# EAGLE design project2 (EAGLE 9.6.2)
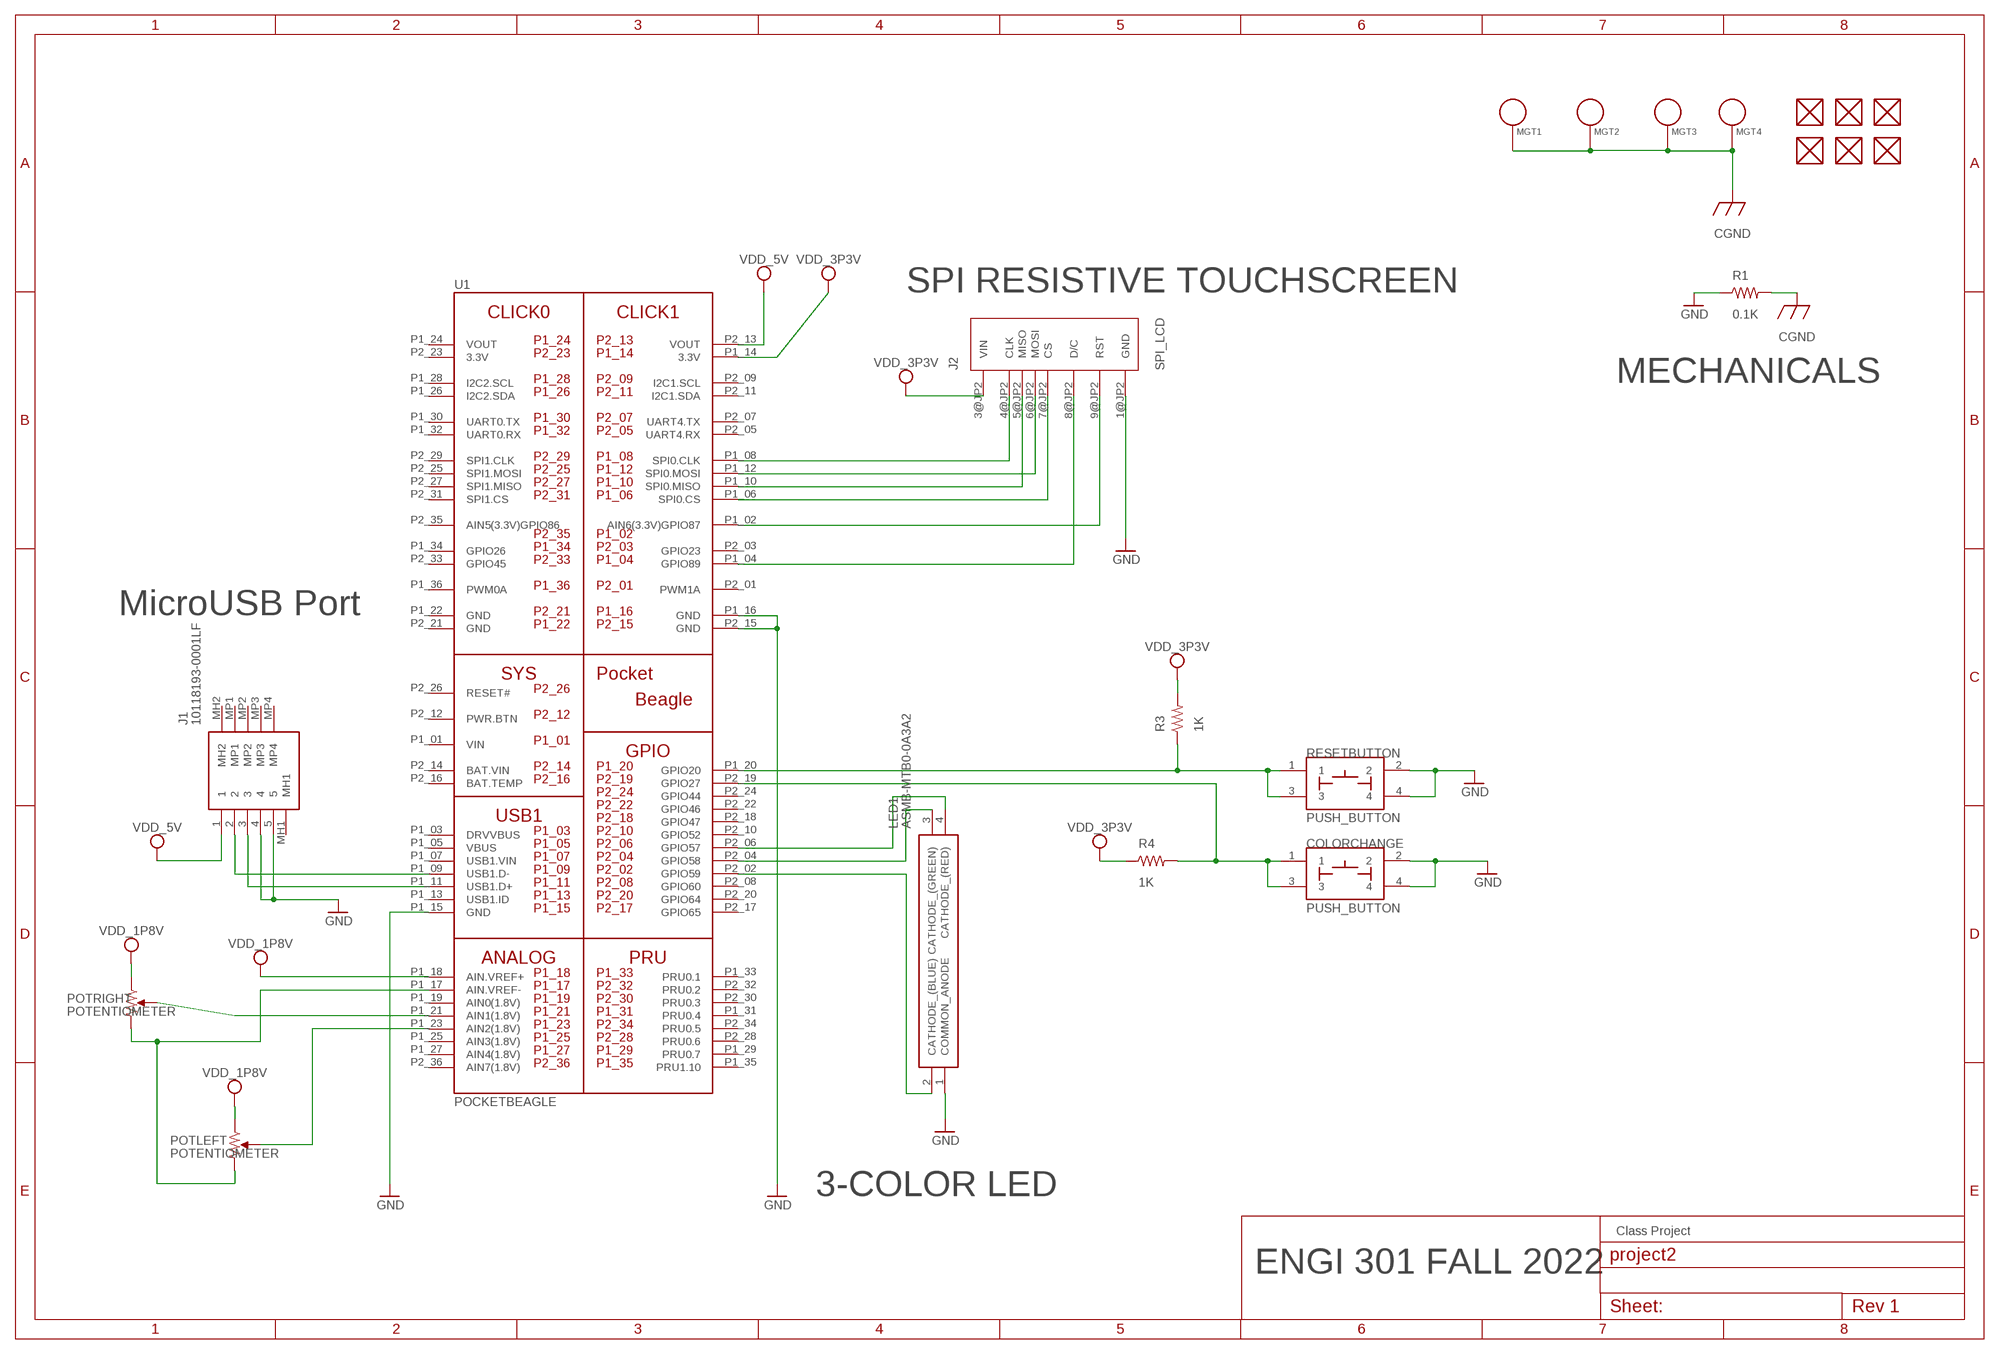
[diagram p0: schematic, sheet 1]

## Parts
COLORCHANGE  PUSH_BUTTON  [BUTTON_12.5MM]
FUD1  FIDUCIAL  [FIDUCIAL_40MIL]
FUD2  FIDUCIAL  [FIDUCIAL_40MIL]
FUD3  FIDUCIAL  [FIDUCIAL_40MIL]
FUD4  FIDUCIAL  [FIDUCIAL_40MIL]
FUD5  FIDUCIAL  [FIDUCIAL_40MIL]
FUD6  FIDUCIAL  [FIDUCIAL_40MIL]
J1  10118193-0001LF  [101181930001LF]
J2  SPI_LCD  [TFT_LCD_PCB]
LED1  ASMB-MTB0-0A3A2  [ASMBMTB00A3A2]
MGT1  MOUNTING_HOLE  [MOUNTING_HOLE]
MGT2  MOUNTING_HOLE  [MOUNTING_HOLE]
MGT3  MOUNTING_HOLE  [MOUNTING_HOLE]
MGT4  MOUNTING_HOLE  [MOUNTING_HOLE]
POTLEFT  POTENTIOMETER  [POT-PO90S]
POTRIGHT  POTENTIOMETER  [POT-PO90S]
R1  0.1K  R_R0603  [R0603]
R3  1K  R_R0603  [R0603]
R4  1K  R_R0603  [R0603]
RESETBUTTON  PUSH_BUTTON  [BUTTON_12.5MM]
U1  POCKETBEAGLE  [POCKETBEAGLE]

## Nets
CGND: MGT1.P$1 MGT2.P$1 MGT3.P$1 MGT4.P$1 R1.2
GND: COLORCHANGE.2 COLORCHANGE.4 J1.4 J1.5 J2.1@JP2(GND) LED1.1(COMMON_ANODE) R1.1 RESETBUTTON.2 RESETBUTTON.4 U1.P1_15(GND) U1.P1_16(GND) U1.P2_15(GND)
N$1: POTRIGHT.S U1.P1_21(AIN1(1.8V))
N$2: POTLEFT.S U1.P1_23(AIN2(1.8V))
N$3: POTLEFT.CW POTRIGHT.CW U1.P1_17(AIN.VREF-)
N$4: R3.1 RESETBUTTON.1 RESETBUTTON.3 U1.P1_20(GPIO20)
N$5: J2.4@JP2(CLK) U1.P1_08(SPI0.CLK)
N$6: J2.5@JP2(MISO) U1.P1_10(SPI0.MISO)
N$7: J2.6@JP2(MOSI) U1.P1_12(SPI0.MOSI)
N$8: J2.7@JP2(CS) U1.P1_06(SPI0.CS)
N$9: J2.8@JP2(D/C) U1.P1_04(GPIO89)
N$10: J2.9@JP2(RST) U1.P1_02(AIN6(3.3V)GPIO87)
N$12: COLORCHANGE.1 COLORCHANGE.3 R4.2 U1.P2_19(GPIO27)
N$13: LED1.2(CATHODE_(BLUE)) U1.P2_02(GPIO59)
N$14: LED1.3(CATHODE_(GREEN)) U1.P2_04(GPIO58)
N$15: LED1.4(CATHODE_(RED)) U1.P2_06(GPIO57)
N$17: J1.2 U1.P1_09(USB1.D-)
N$18: J1.3 U1.P1_11(USB1.D+)
VDD_1P8V: POTLEFT.CCW POTRIGHT.CCW U1.P1_18(AIN.VREF+)
VDD_3P3V: J2.3@JP2(VIN) R3.2 R4.1 U1.P1_14(3.3V)
VDD_5V: J1.1 U1.P2_13(VOUT)
Unconnected: FUD1.P$1 FUD2.P$1 FUD3.P$1 FUD4.P$1 FUD5.P$1 FUD6.P$1 J1.MH1 J1.MH2 J1.MP1 J1.MP2 J1.MP3 J1.MP4 U1.P1_03(DRVVBUS) U1.P1_05(VBUS) U1.P1_07(USB1.VIN) U1.P1_13(USB1.ID) U1.P1_19(AIN0(1.8V)) U1.P1_25(AIN3(1.8V)) U1.P1_26(I2C2.SDA) U1.P1_27(AIN4(1.8V)) U1.P1_28(I2C2.SCL) U1.P1_29(PRU0.7) U1.P1_30(UART0.TX) U1.P1_31(PRU0.4) U1.P1_32(UART0.RX) U1.P1_33(PRU0.1) U1.P1_34(GPIO26) U1.P1_35(PRU1.10) U1.P1_36(PWM0A) U1.P2_01(PWM1A) U1.P2_03(GPIO23) U1.P2_05(UART4.RX) U1.P2_07(UART4.TX) U1.P2_08(GPIO60) U1.P2_09(I2C1.SCL) U1.P2_10(GPIO52) U1.P2_11(I2C1.SDA) U1.P2_12(PWR.BTN) U1.P2_16(BAT.TEMP) U1.P2_17(GPIO65) U1.P2_18(GPIO47) U1.P2_20(GPIO64) U1.P2_22(GPIO46) U1.P2_24(GPIO44) U1.P2_25(SPI1.MOSI) U1.P2_26(RESET#) U1.P2_27(SPI1.MISO) U1.P2_28(PRU0.6) U1.P2_29(SPI1.CLK) U1.P2_30(PRU0.3) U1.P2_31(SPI1.CS) U1.P2_32(PRU0.2) U1.P2_33(GPIO45) U1.P2_34(PRU0.5) U1.P2_35(AIN5(3.3V)GPIO86) U1.P2_36(AIN7(1.8V))

## Notes on the sheet
- SPI RESISTIVE TOUCHSCREEN
- MECHANICALS
- MicroUSB Port
- 3-COLOR LED
- Class Project
- ENGI 301 FALL 2022

## Power pins joined to a net without a drawn wire
3.3V: U1.P2_23(3.3V)
BAT.VIN: U1.P2_14(BAT.VIN)
GND: U1.P1_22(GND) U1.P2_21(GND)
VIN: U1.P1_01(VIN)
VOUT: U1.P1_24(VOUT)

## Library data of the parts
COLORCHANGE RESETBUTTON = project2lib:PUSH_BUTTON
FUD1-FUD6 = project2:FIDUCIAL
J1 = 10118193-0001LF:10118193-0001LF: USB Connectors 5P MICRO USB TYPE B RECEPTACLE W/ PEGS Source: Datasheet <https://cdn.amphenol-icc.com/media/wysiwyg/files/drawing/10118193.pdf>; DESCRIPTION: USB Connectors 5P MICRO USB TYPE B RECEPTACLE W/ PEGS; HEIGHT: 3.3mm; MANUFACTURER_NAME: Amphenol Communication Solutions; MANUFACTURER_PART_NUMBER: 10118193-0001LF; MOUSER_PART_NUMBER: 649-10118193-0001LF; MOUSER_PRICE-STOCK: https://www.mouser.co.uk/ProductDetail/Amphenol-FCI/10118193-0001LF?qs=Ywefl8B65e63Nsqd%252B8HZaQ%3D%3D
J2 = project2:SPI_LCD
LED1 = project2lib:ASMB-MTB0-0A3A2: LED Tri-Color Blue/Green/Red 465nm/522nm/634nm Chip LED 4-Pin PLCC - Tape and Reel Source: Datasheet <https://componentsearchengine.com/Datasheets/2/ASMB-MTB0-0A3A2.pdf>; DESCRIPTION: LED Tri-Color Blue/Green/Red 465nm/522nm/634nm Chip LED 4-Pin PLCC - Tape and Reel; HEIGHT: 1.9mm; MANUFACTURER_NAME: Avago Technologies; MANUFACTURER_PART_NUMBER: ASMB-MTB0-0A3A2; MOUSER_PART_NUMBER: 630-ASMB-MTB0-0A3A2; MOUSER_PRICE-STOCK: https://www.mouser.co.uk/ProductDetail/Broadcom-Avago/ASMB-MTB0-0A3A2?qs=ToP8pWlZ0bPcx4XpibrdbA%3D%3D
MGT1-MGT4 = project2:MOUNTING_HOLE: Chassis Mounting Hole w/GND connection ability
POTLEFT POTRIGHT = project2lib:POTENTIOMETER: Potentiometer - Examples: P090S-14T20BR10K (987-1277-ND)
R1 = project2:R_: RESISTOR, American symbol
R3 R4 = project2lib:R_: RESISTOR, American symbol
U1 = project2lib:POCKETBEAGLE

## Board
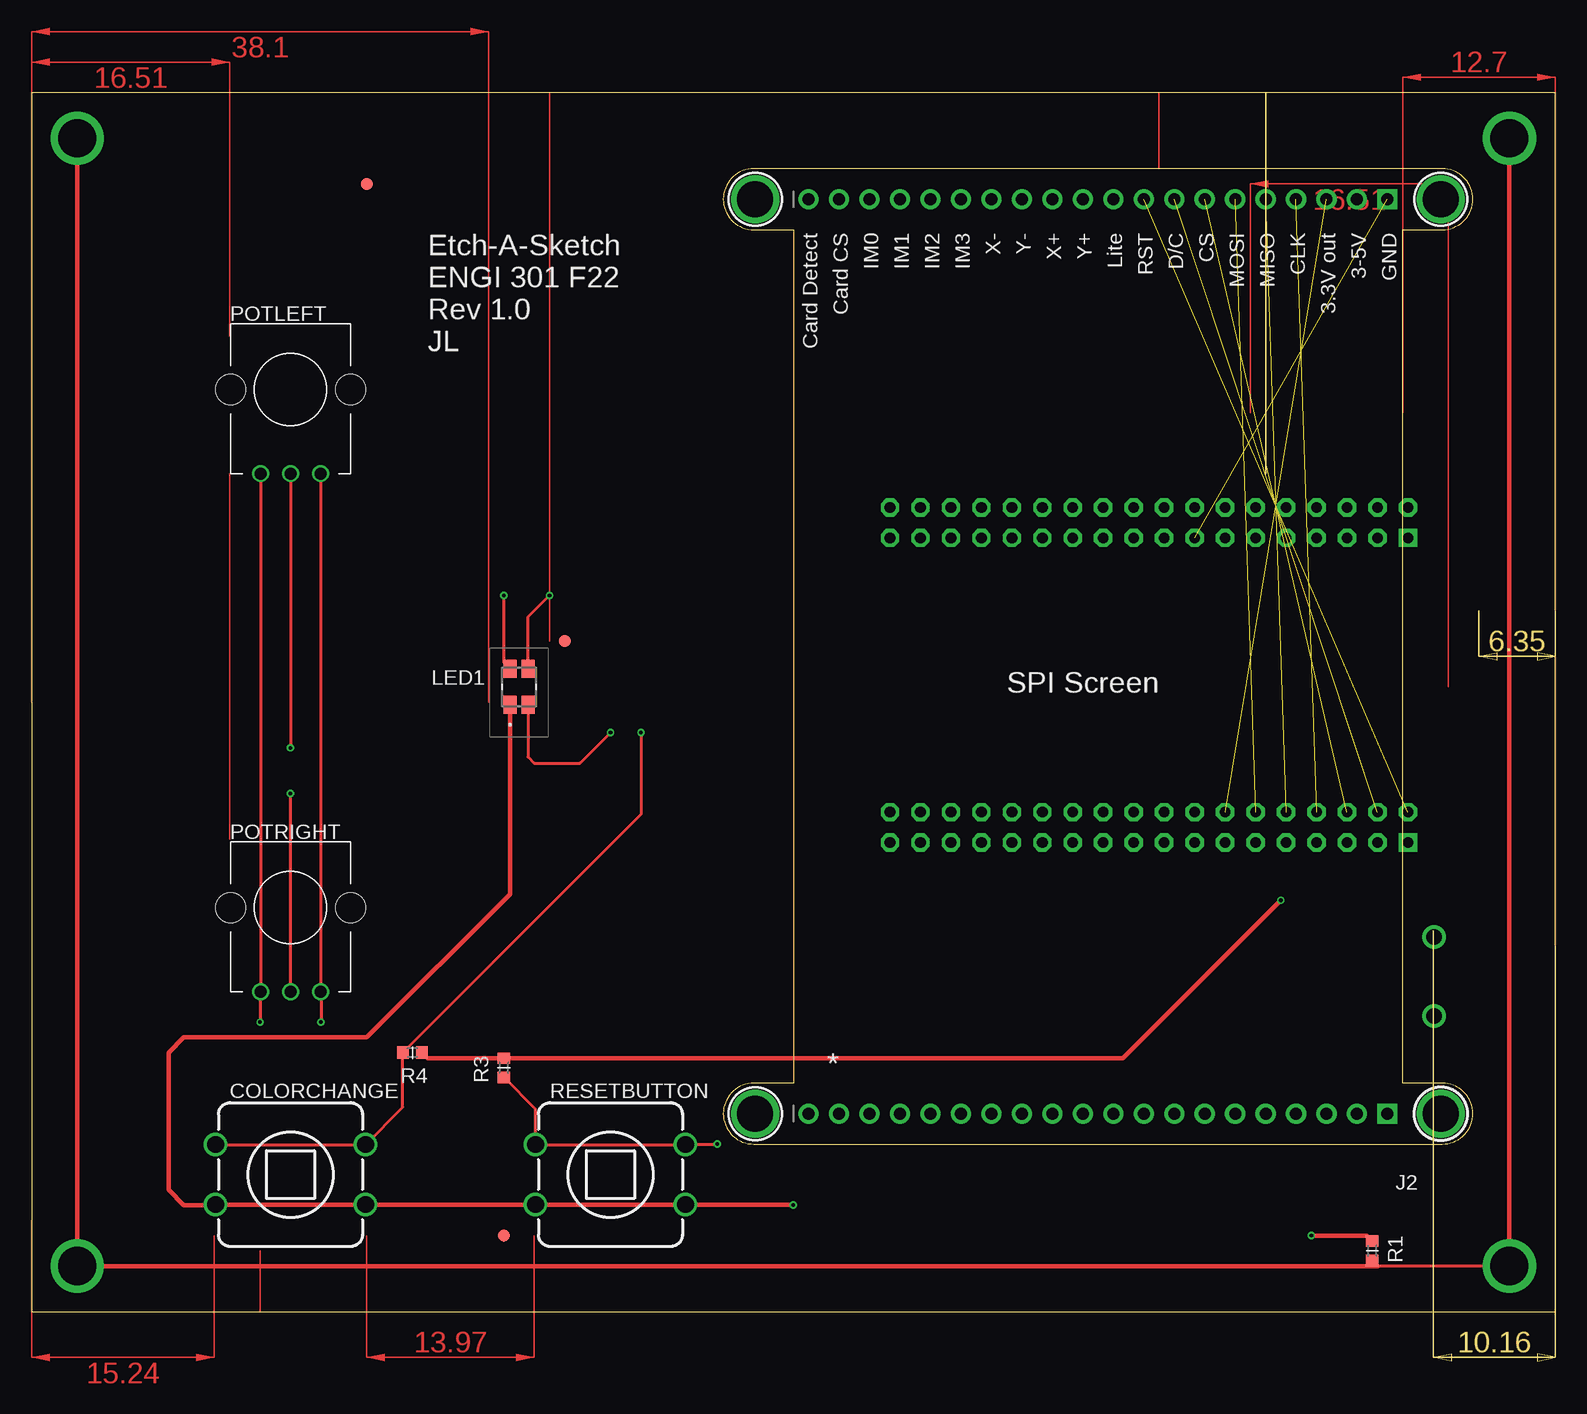
[diagram p1: board, top side]
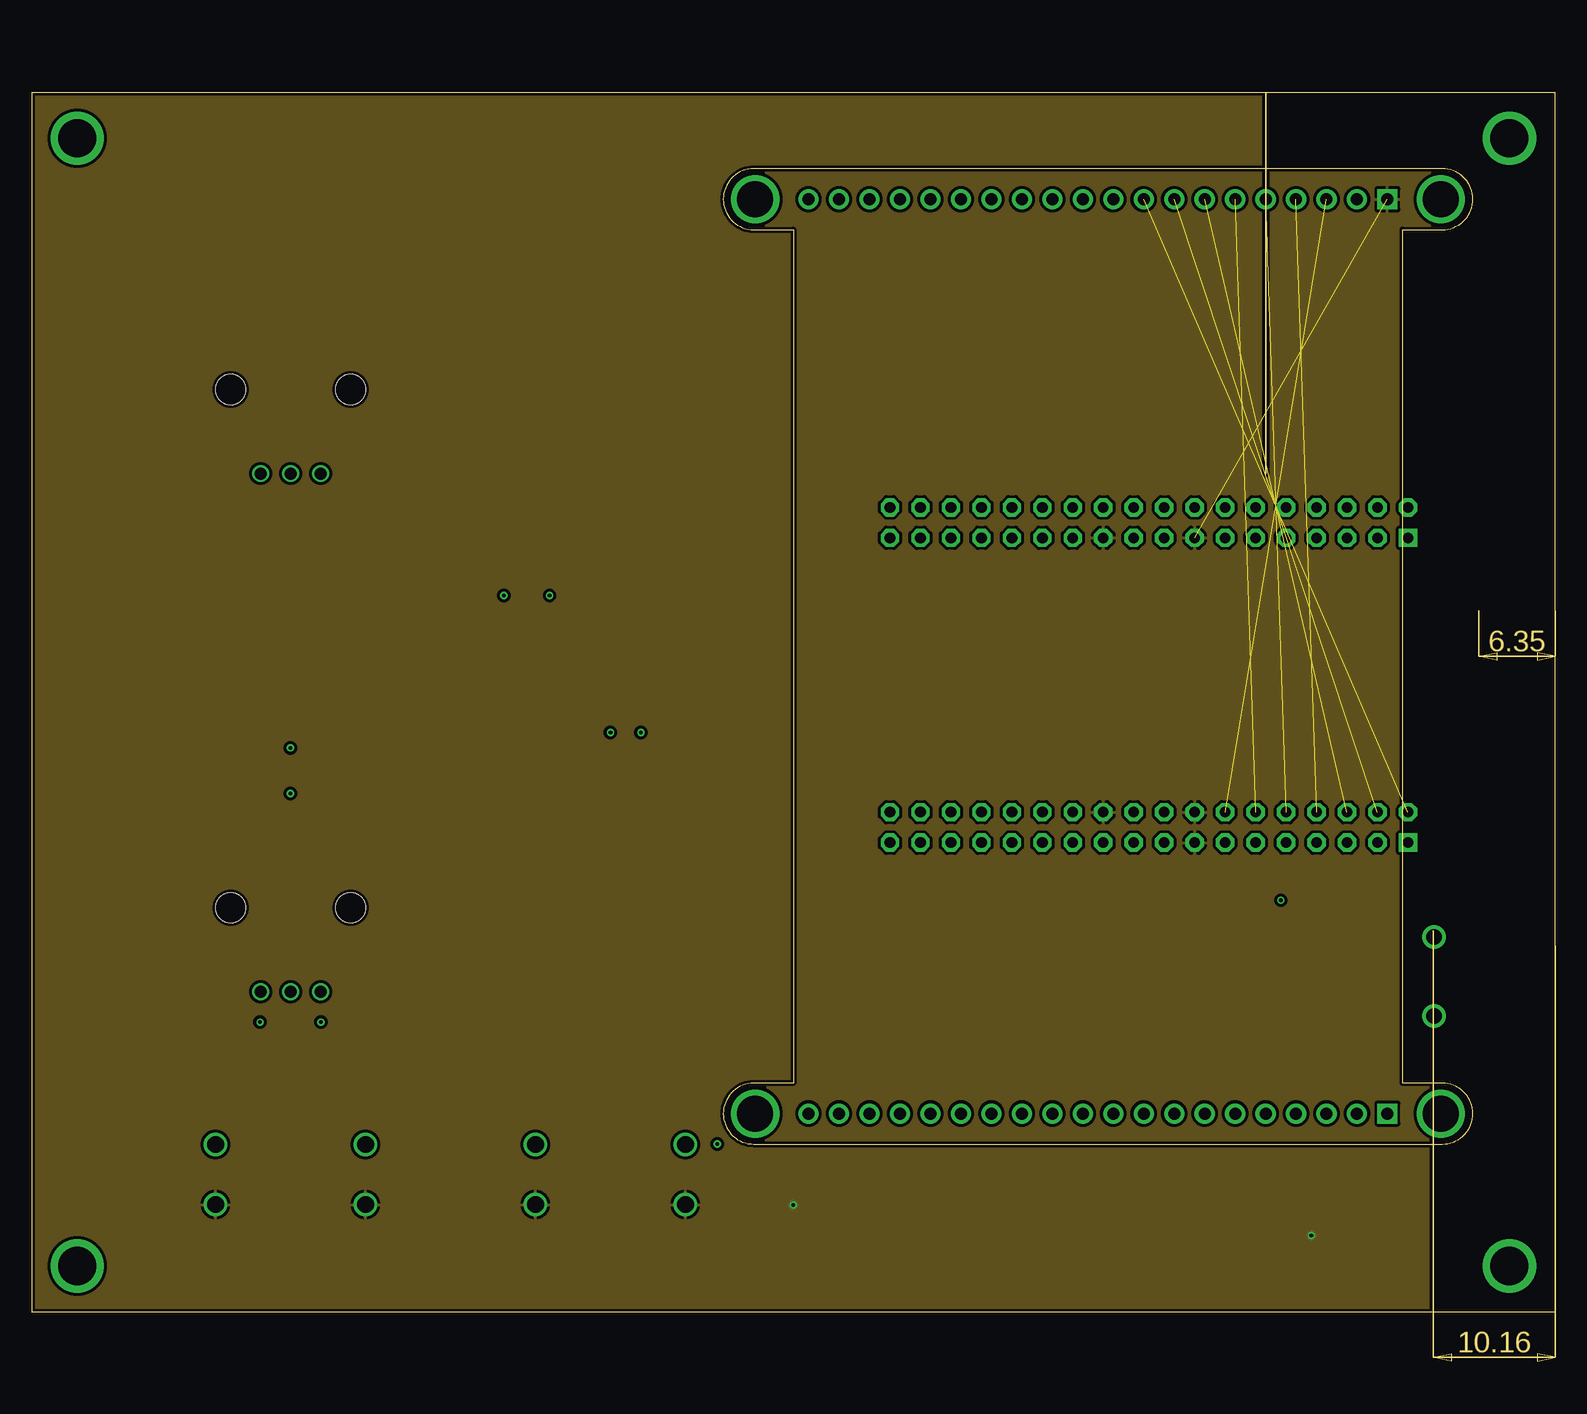
[diagram p2: board, inner layer Route2]
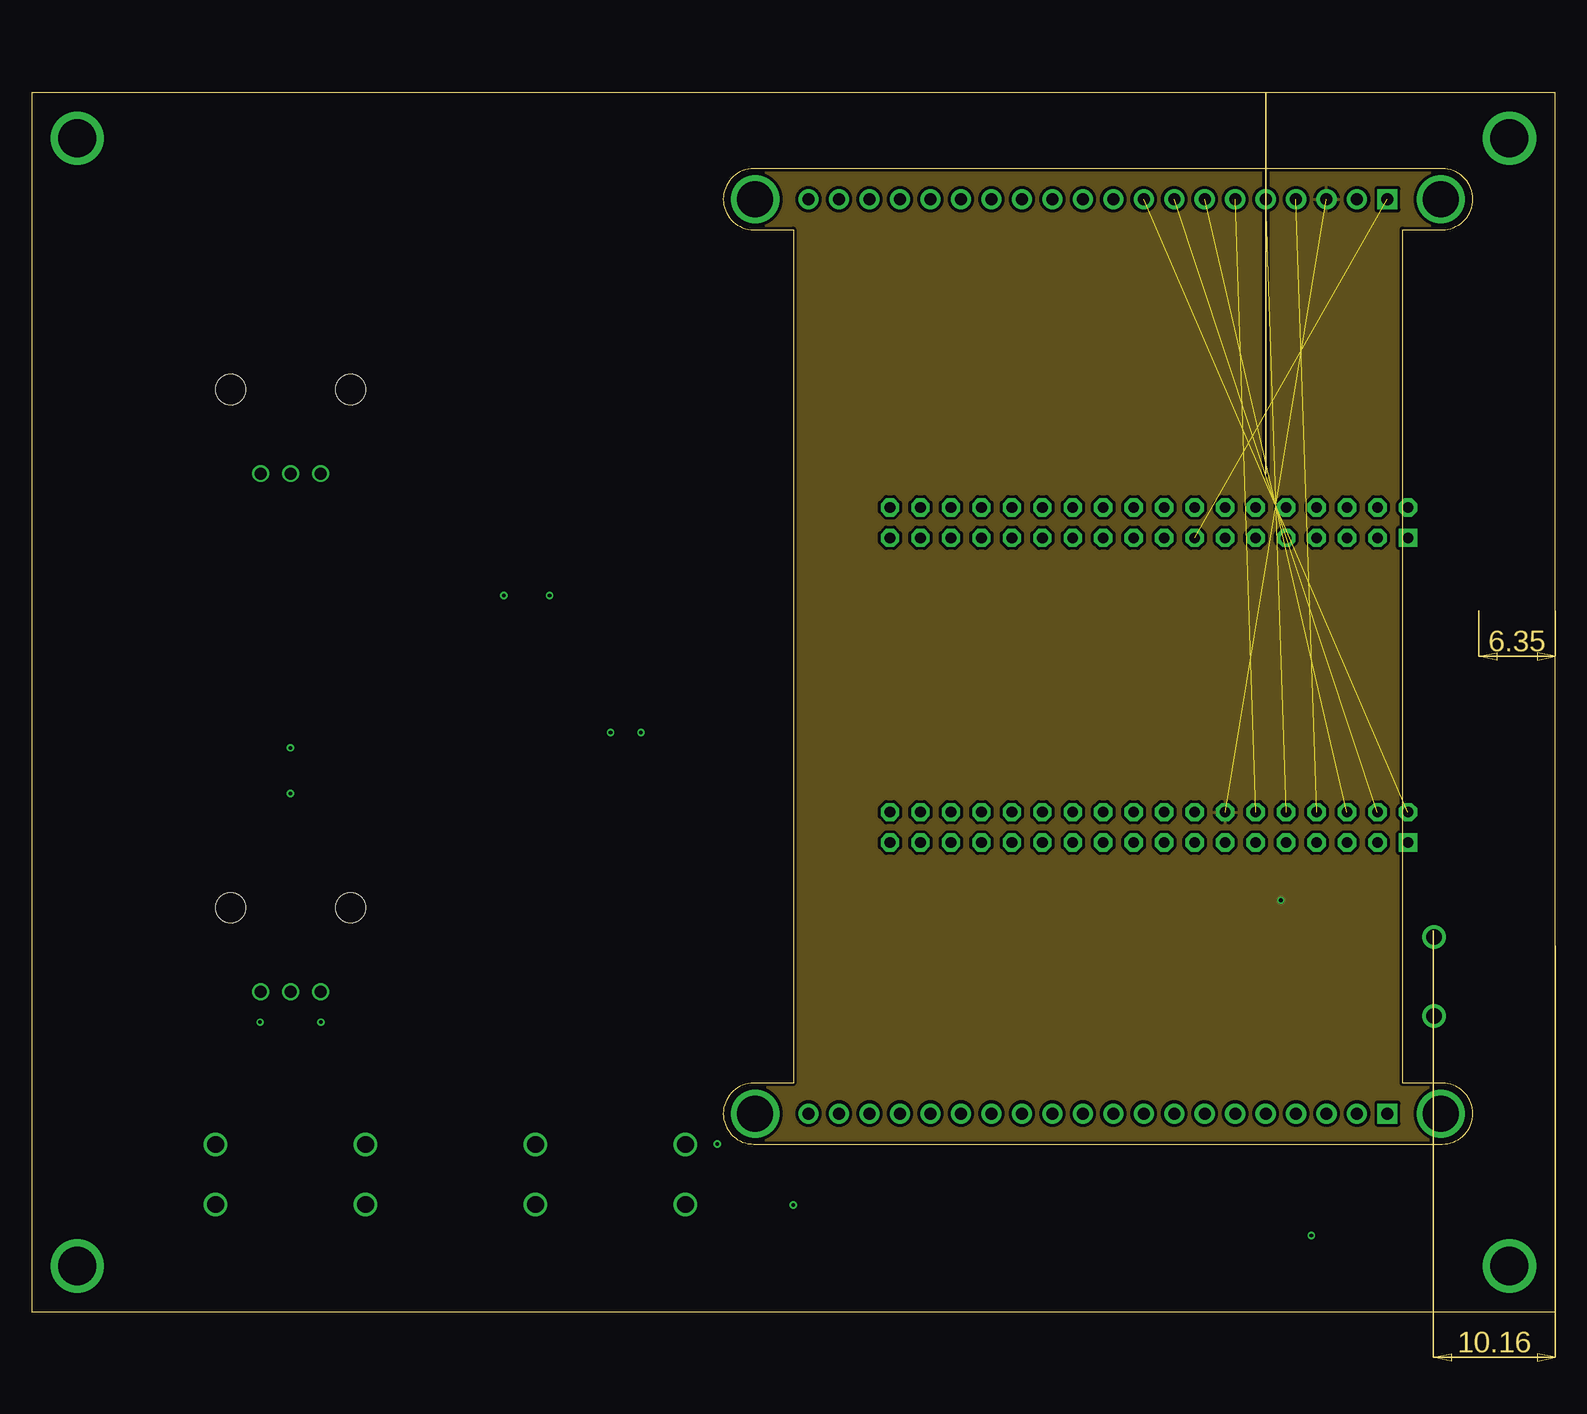
[diagram p3: board, inner layer Route15]
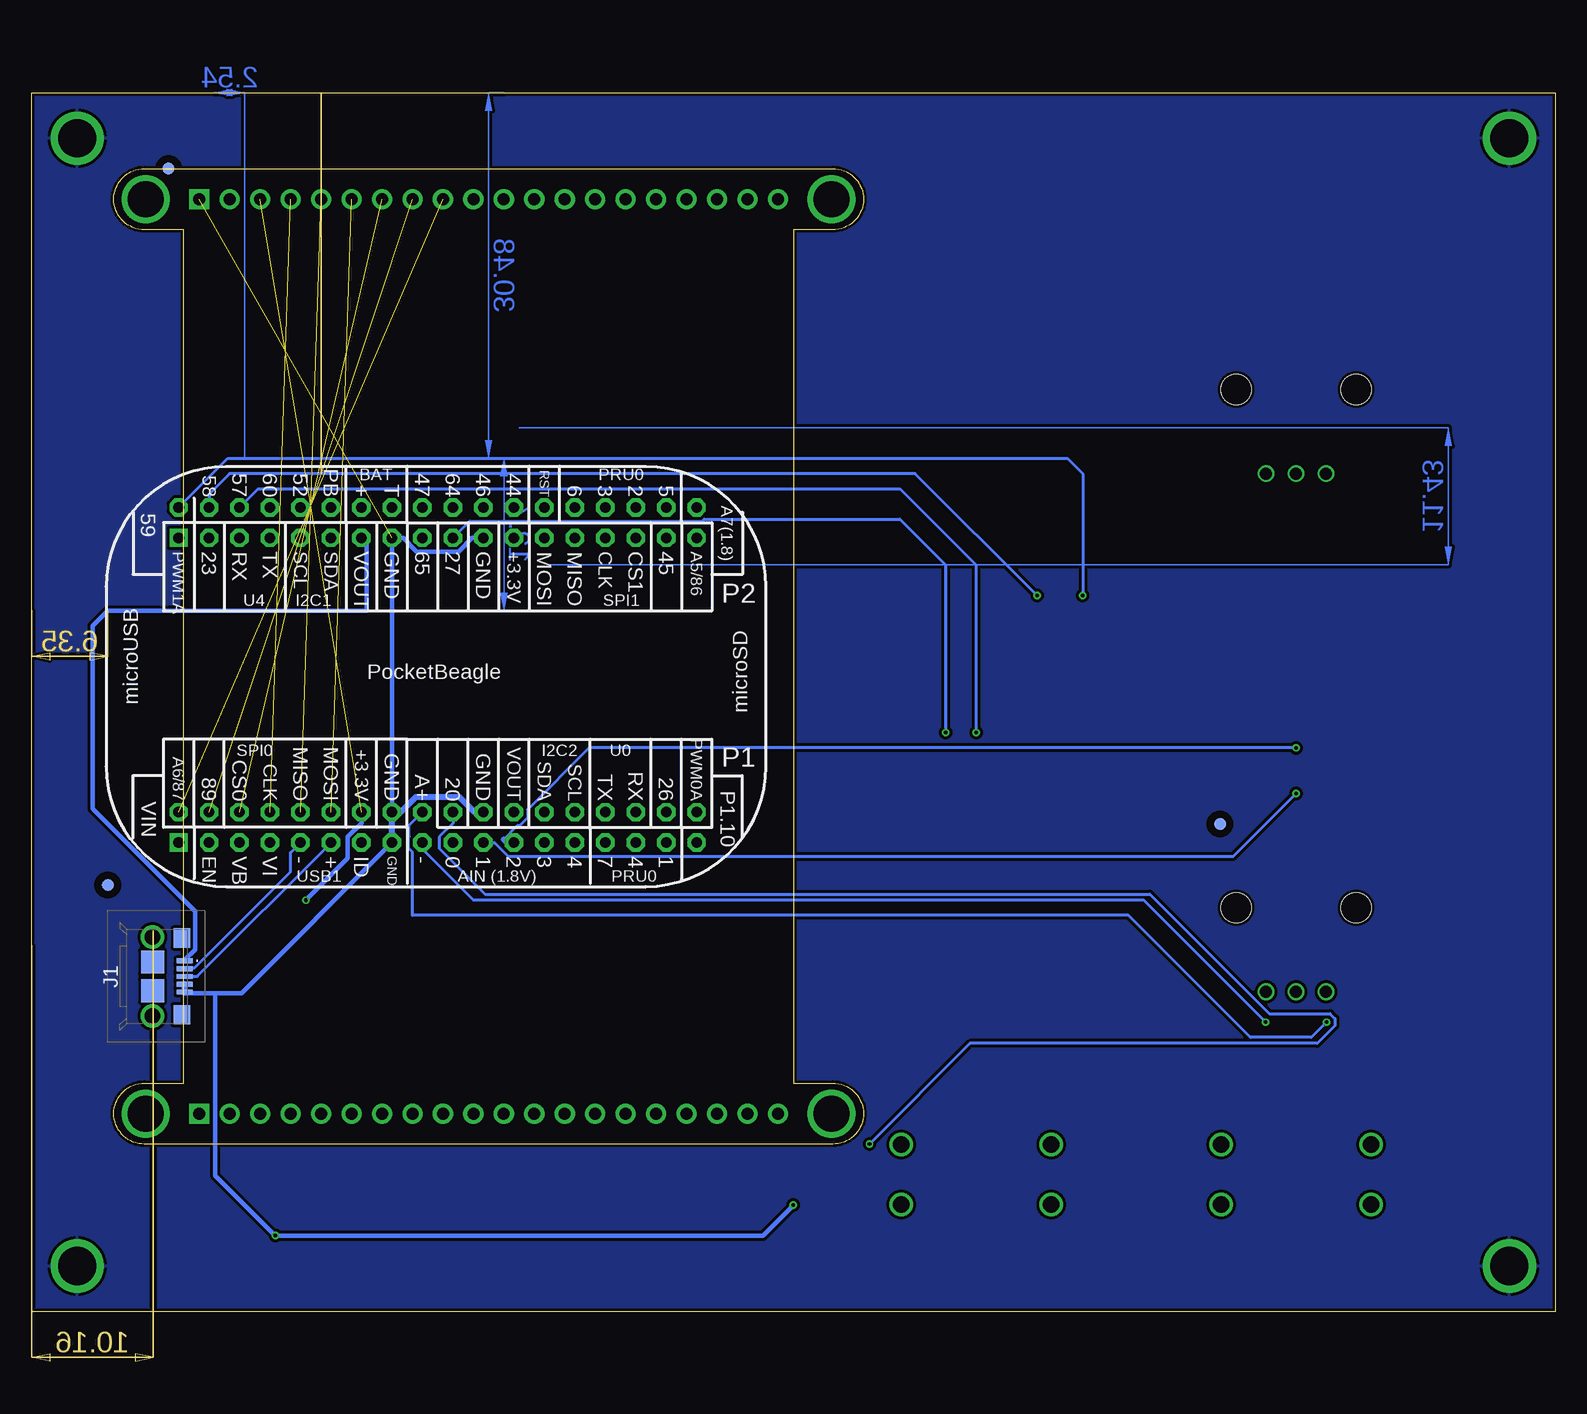
[diagram p4: board, bottom side, seen from below]

Size 127 x 101.6 mm. Coordinates in mm from the lower left corner, seen from the top.
Outline: 0,0 127,0 127,101.6 0,101.6 0,0
Copper layers (1*2*15*16): Top 0.035mm / dielectric 0.23mm / Route2 0.035mm / dielectric 0.93mm / Route15 0.035mm / dielectric 0.23mm / Bottom 0.035mm
Design rules "ENGI301_4lyr": minimum track width 10mil, minimum drill 12mil, track to track 10mil, track to pad 10mil, pad to pad 10mil, via to via 10mil, smd to smd 10mil, copper to edge 10mil, drill to drill 12mil, minimum pad ring 6mil, minimum via ring 6mil, stop-mask expansion 3mil, vias tented up to drill 25mil, thermal gap 10mil

### Footprints (pad centres in the part's own frame; a part is rotated, then mirrored left to right if it is on the bottom)
BUTTON_12.5MM = drill 1.4: 1 -6.25,2.5; 2 -6.25,-2.5; 3 6.25,2.5; 4 6.25,-2.5
FIDUCIAL_40MIL = smd 1.016 x 1.016: P$1 0,0
101181930001LF = smd 0.4 x 1.35: 1 -1.3,2.605; 2 -0.65,2.605; 3 0,2.605; 4 0.65,2.605; 5 1.3,2.605 | drill 1.3 pad 1.95: MH1 -3.3,-0.07; MH2 3.3,-0.07 | smd 1.6 x 1.4: MP1 -3.2,2.38; MP2 3.2,2.38 | smd 1.9 x 1.9: MP3 -1.2,-0.07; MP4 1.2,-0.07
TFT_LCD_PCB = drill 1 pad 1.676 square: 1@JP1 -24.13,38.1; 1@JP2 -24.13,-38.1 | drill 1 pad 1.676: 2@JP1 -21.59,38.1; 2@JP2 -21.59,-38.1; 3@JP1 -19.05,38.1; 3@JP2 -19.05,-38.1; 4@JP1 -16.51,38.1; 4@JP2 -16.51,-38.1; 5@JP1 -13.97,38.1; 5@JP2 -13.97,-38.1; 6@JP1 -11.43,38.1; 6@JP2 -11.43,-38.1; 7@JP1 -8.89,38.1; 7@JP2 -8.89,-38.1; 8@JP1 -6.35,38.1; 8@JP2 -6.35,-38.1; 9@JP1 -3.81,38.1; 9@JP2 -3.81,-38.1; 10@JP1 -1.27,38.1; 10@JP2 -1.27,-38.1; 11@JP1 1.27,38.1; 11@JP2 1.27,-38.1; 12@JP1 3.81,38.1; 12@JP2 3.81,-38.1; 13@JP1 6.35,38.1; 13@JP2 6.35,-38.1; 14@JP1 8.89,38.1; 14@JP2 8.89,-38.1; 15@JP1 11.43,38.1; 15@JP2 11.43,-38.1; 16@JP1 13.97,38.1; 16@JP2 13.97,-38.1; 17@JP1 16.51,38.1; 17@JP2 16.51,-38.1; 18@JP1 19.05,38.1; 18@JP2 19.05,-38.1; 19@JP1 21.59,38.1; 19@JP2 21.59,-38.1; 20@JP1 24.13,38.1; 20@JP2 24.13,-38.1 | drill 3 pad 3.6: P$1@U$7 -28.575,-38.1; P$1@U$15 28.575,-38.1; P$1@U$16 -28.575,38.1; P$1@U$17 28.575,38.1
ASMBMTB00A3A2 = smd 1.1 x 1.5: 1 -0.75,-1.5; 2 -0.75,1.5; 3 0.75,1.5; 4 0.75,-1.5
MOUNTING_HOLE = drill 3.175 pad 4.445: P$1 0,0
POT-PO90S = drill 1: CCW -2.5,0; CW 2.5,0; S 0,0 | hole 2.5: -5,7; 5,7
R0603 = smd 0.95 x 1.031: 1 -0.8,0; 2 0.8,0
POCKETBEAGLE = drill 0.889 pad 1.524 square: P1_01 5.91,3.53; P2_01 5.91,28.93 | drill 0.889 pad 1.524 octagon: P1_02 5.91,6.07; P1_03 8.45,3.53; P1_04 8.45,6.07; P1_05 10.99,3.53; P1_06 10.99,6.07; P1_07 13.53,3.53; P1_08 13.53,6.07; P1_09 16.07,3.53; P1_10 16.07,6.07; P1_11 18.61,3.53; P1_12 18.61,6.07; P1_13 21.15,3.53; P1_14 21.15,6.07; P1_15 23.69,3.53; P1_16 23.69,6.07; P1_17 26.23,3.53; P1_18 26.23,6.07; P1_19 28.77,3.53; P1_20 28.77,6.07; P1_21 31.31,3.53; P1_22 31.31,6.07; P1_23 33.85,3.53; P1_24 33.85,6.07; P1_25 36.39,3.53; P1_26 36.39,6.07; P1_27 38.93,3.53; P1_28 38.93,6.07; P1_29 41.47,3.53; P1_30 41.47,6.07; P1_31 44.01,3.53; P1_32 44.01,6.07; P1_33 46.55,3.53; P1_34 46.55,6.07; P1_35 49.09,3.53; P1_36 49.09,6.07; P2_02 5.91,31.47; P2_03 8.45,28.93; P2_04 8.45,31.47; P2_05 10.99,28.93; P2_06 10.99,31.47; P2_07 13.53,28.93; P2_08 13.53,31.47; P2_09 16.07,28.93; P2_10 16.07,31.47; P2_11 18.61,28.93; P2_12 18.61,31.47; P2_13 21.15,28.93; P2_14 21.15,31.47; P2_15 23.69,28.93; P2_16 23.69,31.47; P2_17 26.23,28.93; P2_18 26.23,31.47; P2_19 28.77,28.93; P2_20 28.77,31.47; P2_21 31.31,28.93; P2_22 31.31,31.47; P2_23 33.85,28.93; P2_24 33.85,31.47; P2_25 36.39,28.93; P2_26 36.39,31.47; P2_27 38.93,28.93; P2_28 38.93,31.47; P2_29 41.47,28.93; P2_30 41.47,31.47; P2_31 44.01,28.93; P2_32 44.01,31.47; P2_33 46.55,28.93; P2_34 46.55,31.47; P2_35 49.09,28.93; P2_36 49.09,31.47

### Placement (x,y rotation side)
COLORCHANGE  21.59,11.43 0 top
FUD1  39.37,6.35 0 top
FUD2  27.94,93.98 0 top
FUD3  27.94,40.64 0 bottom
FUD4  115.57,95.25 0 bottom
FUD5  120.65,35.56 0 bottom
FUD6  44.45,55.88 0 top
J1  116.84,27.94 270 bottom
J2  88.9,54.61 180 top
LED1  40.64,52.07 0 top
MGT1  3.81,3.81 0 top
MGT2  3.81,97.79 0 top
MGT3  123.19,97.79 0 top
MGT4  123.19,3.81 0 top
POTLEFT  21.59,69.85 0 top
POTRIGHT  21.59,26.67 0 top
R1  111.76,5.08 270 top
R3  39.37,20.32 90 top
R4  31.75,21.59 180 top
RESETBUTTON  48.26,11.43 0 top
U1  120.65,35.56 0 bottom

### Tracks (layer width: path | path; a pad name or v marks a point on that pad's centre or on a via)
CGND
  Top 0.254: R1.2 112.23,3.81 MGT4.P$1
  Top 0.381: MGT2.P$1 MGT1.P$1 112.23,3.81 | MGT3.P$1 MGT4.P$1
  pour Bottom: 128.27,102.87 -1.27,102.87 -1.27,-1.27 128.27,-1.27
  pour Bottom: 125.73,46.99 125.73,93.98 119.38,93.98 119.38,100.33 7.62,100.33 7.62,93.98 1.27,93.98 1.27,46.99 -1.27,46.99 1.27,46.99 1.27,7.62 7.62,7.62 7.62,1.27 119.38,1.27 119.38,7.62 125.73,7.62 125.73,46.99
GND  (via drill 0.3)  (1 unrouted)
  Top 0.254: 15.3,8.89 COLORCHANGE.2 | 63.46,8.93 v63.5,8.89 | 111.29,6.35 R1.1
  Top 0.381: COLORCHANGE.2 COLORCHANGE.4 RESETBUTTON.2 RESETBUTTON.4 63.46,8.93 | LED1.1 39.89,34.81 27.94,22.86 12.7,22.86 11.43,21.59 11.43,10.16 12.7,8.89 15.3,8.89 | v106.68,6.35 111.29,6.35
  Bottom 0.254: 106.69,6.35 v106.68,6.35 | J1.5 114.27,26.67 114.3,26.67 | 114.3,27.23 J1.4
  Bottom 0.381: U1.P2_21 90.26,64.49 91.41,63.35 94.89,63.35 96.04,64.49 U1.P2_15 96.96,41.91 | 106.69,6.35 111.69,11.35 111.69,26.55 | 97.23,38.81 109.5,26.55 111.69,26.55 | 111.69,26.55 114.23,26.55 | v106.68,6.35 66.04,6.35 v63.5,8.89 | 114.3,26.67 114.3,27.23
  Bottom 0.508: J1.4 114.23,26.55 | U1.P1_16 U1.P1_15 97.23,38.81 | U1.P1_16 96.22,41.63 94.95,42.9 91.35,42.9 90.08,41.63 U1.P1_22 | U1.P1_16 96.96,41.91
  pour Route2: -2.54,104.14 -2.54,-2.54 129.54,-2.54 129.54,104.14
N$1  (via drill 0.3)
  Top 0.254: POTRIGHT.S v21.59,43.18
  Bottom 0.254: U1.P1_21 88.42,39.09 87.27,37.95 26.82,37.95 v21.59,43.18
N$2  (via drill 0.3)
  Top 0.254: POTLEFT.S v21.59,46.99
  Bottom 0.254: 87.63,39.37 86.51,40.49 86.33,40.49 85.66,41.16 85.66,41.85 80.52,46.99 v21.59,46.99
  Bottom 0.508: U1.P1_23 87.35,39.09 87.63,39.37
N$3  (via drill 0.3)
  Top 0.254: POTLEFT.CW POTRIGHT.CW 24.13,26.63 v24.13,24.13
  Bottom 0.254: v24.13,24.13 34.29,34.29 90.17,34.29 94.42,38.54 U1.P1_17
N$4  (via drill 0.3)
  Top 0.254: R3.1 42.01,16.88 RESETBUTTON.1 RESETBUTTON.3 54.55,13.97 v57.15,13.97
  Bottom 0.254: U1.P1_20 91.88,40.71 93.02,39.56 93.02,38.62 89.2,34.8 33.8,34.8 23.84,24.84 18.76,24.84 18.34,24.42 18.34,23.84 19.83,22.35 48.77,22.35 v57.15,13.97
N$5  (1 unrouted)
N$6  (1 unrouted)
N$7  (1 unrouted)
N$8  (1 unrouted)
N$9  (1 unrouted)
N$10  (1 unrouted)
N$12  (via drill 0.3)
  Top 0.254: COLORCHANGE.1 COLORCHANGE.3 30.95,17.04 R4.2 50.8,41.44 v50.8,48.26
  Bottom 0.254: U1.P2_19 90.48,65.89 71.09,65.89 70.93,66.04 54.61,66.04 50.8,62.23 v50.8,48.26
N$13  (via drill 0.3)
  Top 0.254: LED1.2 39.37,54.09 v39.37,59.69
  Bottom 0.254: U1.P2_02 110.65,71.12 40.64,71.12 39.37,69.85 v39.37,59.69
N$14  (via drill 0.3)
  Top 0.254: LED1.3 41.39,57.9 v43.18,59.69
  Bottom 0.254: v43.18,59.69 53.34,69.85 110.49,69.85 112.2,68.14 U1.P2_04
N$15  (via drill 0.3)
  Top 0.254: LED1.4 41.39,46.24 41.91,45.72 45.72,45.72 v48.26,48.26
  Bottom 0.254: U1.P2_06 108.11,68.58 54.61,68.58 48.26,62.23 v48.26,48.26
N$17
  Bottom 0.254: J1.2 114.17,28.66 113.4,28.66 105.41,36.65 105.41,38.26 U1.P1_09
N$18
  Bottom 0.254: J1.3 113.19,27.94 U1.P1_11
VDD_1P8V  (via drill 0.3)
  Top 0.254: POTLEFT.CCW POTRIGHT.CCW 19.05,26.63 v19.05,24.13
  Bottom 0.254: v19.05,24.13 20.32,22.86 25.4,22.86 35.56,33.02 95.25,33.02 95.25,38.3 95.56,38.62 95.56,39.56 95.51,39.62 95.51,40.54 U1.P1_18
VDD_3P3V  (via drill 0.3)  (1 unrouted)
  Top 0.254: R4.1 33.02,21.12
  Top 0.381: 33.02,21.12 R3.2 90.97,21.12 v104.14,34.29
  Bottom 0.381: U1.P1_14 99.5,40.71 100.64,39.56 100.64,37.79 v104.14,34.29
  pour Route15: -5.08,106.68 -5.08,-5.08 132.08,-5.08 132.08,106.68
VDD_5V
  Bottom 0.254: J1.1 114.23,29.33 | 99.06,64.05 U1.P2_13
  Bottom 0.381: 114.23,29.33 113.38,30.18 113.38,33.37 121.92,41.91 121.92,57.15 120.65,58.42 99.06,58.42 99.06,64.05
(copper drawn outside any net)
  shapes: Bottom area x4, Top area x13

### Text on the board
tPlace: Etch-A-Sketch / ENGI 301 F22 / Rev 1.0 / JL